# Altium schematic sheet NAND.SchDoc
size A4; PageSetup: Record=PageOptions|CenterHorizontal=False|CenterVertical=False|PrintScale=0.95|XCorrection=0.00|YCorrection=0.00|PrintKind=1|BorderSize=5000000|LeftOffset=0|BottomOffset=0|Orientation=1|PaperLength=1000|PaperWidth=1000|Scale=100|PaperSource=15|PrintQuality=600|MediaType=1|DitherType=10|PaperKind=A4|PrintScaleMode=1; Organization: My Company; Address1: Address Line 1; Address2: Address Line 2; Address3: Address Line 3; Address4: Address Line 4; SheetNumber: 4; SheetTotal: 6
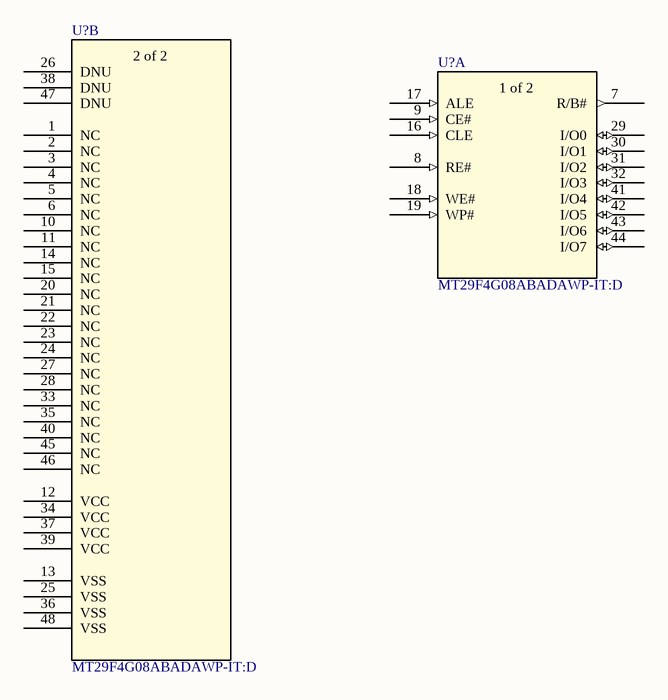
[diagram p0: NAND.SchDoc]

## Parts
(Parts that share a designator on the sheet are numbered #1, #2 ... from top to bottom, then left to right.)
U?#1  MT29F4G08ABADAWP-IT:D  [TSOP48_TYPE1_CPL_MRN]  (part B of 2)
U?#2  MT29F4G08ABADAWP-IT:D  [TSOP48_TYPE1_CPL_MRN]  (part A of 2)

## Nets

Not connected (* = marked no-connect by the designer): U?#1 1(NC) 2(NC) 3(NC) 4(NC) 5(NC) 6(NC) 10(NC) 11(NC) 12(VCC) 13(VSS) 14(NC) 15(NC) 20(NC) 21(NC) 22(NC) 23(NC) 24(NC) 25(VSS) 26(DNU) 27(NC) 28(NC) 33(NC) 34(VCC) 35(NC) 36(VSS) 37(VCC) 38(DNU) 39(VCC) 40(NC) 45(NC) 46(NC) 47(DNU) 48(VSS); U?#2 7(R/B#) 8(RE#) 9(CE#) 16(CLE) 17(ALE) 18(WE#) 19(WP#) 29(I/O0) 30(I/O1) 31(I/O2) 32(I/O3) 41(I/O4) 42(I/O5) 43(I/O6) 44(I/O7)

## Notes on the sheet
- Title:
- Author:
- Approved:
- Size:
- Date:
- Git Hash:
- A4
- Prj:
- SW Version:
- Variant:
- Edited:
- CONFIDENTIAL
- File:
- (in symbol MT29F4G08ABADAWP-IT:D, part A) 1 of 2
- (in symbol MT29F4G08ABADAWP-IT:D, part B) 2 of 2

## Library data of the parts
U?#1 U?#2 = MT29F4G08ABADAWP-IT:D: No Description Available; SourceLibrary: Add_to_database_2020-12-08; Built_By: EMA_Cory; Vendor: Micron; Datasheet: https://www.mouser.com/datasheet/2/671/micron_technology_micts06228-1-1759217.pdf; Copyright: Copyright (C) 2018 Accelerated Designs. All rights reserved; Manufacturer_Part_Number: MT29F4G08ABADAWP-IT:D; RefDes: RefDes; Type: DEV